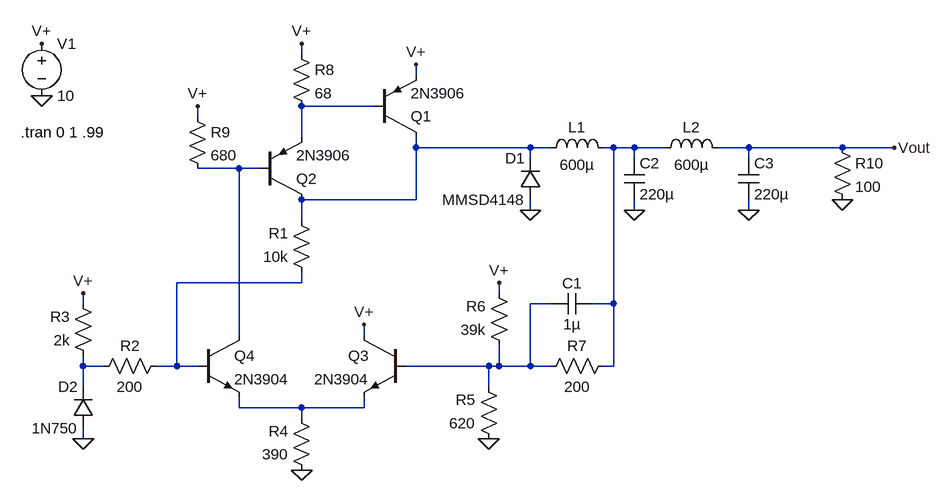
[diagram p0: schematic 09H-16.asc]
09H-16.asc, the LTspice schematic file:
Version 4.1
SHEET 1 1160 680
WIRE 176 -80 176 -96
WIRE 352 -48 352 -64
WIRE 288 0 176 0
WIRE 16 16 16 0
WIRE 176 48 176 0
WIRE 352 64 352 48
WIRE 528 64 352 64
WIRE 560 64 528 64
WIRE 656 64 640 64
WIRE 688 64 656 64
WIRE 736 64 688 64
WIRE 864 64 816 64
WIRE 1008 64 864 64
WIRE 1088 64 1008 64
WIRE 528 80 528 64
WIRE 688 80 688 64
WIRE 864 80 864 64
WIRE 80 96 16 96
WIRE 112 96 80 96
WIRE 352 144 352 64
WIRE 352 144 176 144
WIRE 528 160 528 144
WIRE 688 160 688 144
WIRE 864 160 864 144
WIRE 176 176 176 144
WIRE 176 272 176 256
WIRE 176 272 -16 272
WIRE 480 288 480 272
WIRE -160 304 -160 288
WIRE 560 304 528 304
WIRE 656 304 656 64
WIRE 656 304 624 304
WIRE 80 352 80 96
WIRE 272 352 272 336
WIRE -160 400 -160 384
WIRE -128 400 -160 400
WIRE -16 400 -16 272
WIRE -16 400 -48 400
WIRE 16 400 -16 400
WIRE 464 400 336 400
WIRE 480 400 480 368
WIRE 480 400 464 400
WIRE 528 400 528 304
WIRE 528 400 480 400
WIRE 560 400 528 400
WIRE 656 400 656 304
WIRE 656 400 640 400
WIRE -160 432 -160 400
WIRE 464 432 464 400
WIRE 80 464 80 448
WIRE 176 464 80 464
WIRE 272 464 272 448
WIRE 272 464 176 464
WIRE 176 480 176 464
WIRE -160 512 -160 496
FLAG -160 512 0
FLAG 176 560 0
FLAG 464 512 0
FLAG 528 160 0
FLAG 688 160 0
FLAG 864 160 0
FLAG -160 288 V+
FLAG 272 336 V+
FLAG 480 272 V+
FLAG 352 -64 V+
FLAG 176 -96 V+
FLAG 16 0 V+
FLAG 1088 64 Vout
FLAG -224 -16 0
FLAG -224 -96 V+
FLAG 1008 144 0
SYMBOL pnp 288 48 M180
SYMATTR InstName Q1
SYMATTR Value 2N3906
SYMBOL pnp 112 144 M180
SYMATTR InstName Q2
SYMATTR Value 2N3906
SYMBOL npn 336 352 M0
SYMATTR InstName Q3
SYMATTR Value 2N3904
SYMBOL npn 16 352 R0
SYMATTR InstName Q4
SYMATTR Value 2N3904
SYMBOL res 192 272 R180
WINDOW 0 36 76 Left 2
WINDOW 3 36 40 Left 2
SYMATTR InstName R1
SYMATTR Value 10k
SYMBOL res -32 384 R90
WINDOW 0 0 56 VBottom 2
WINDOW 3 32 56 VTop 2
SYMATTR InstName R2
SYMATTR Value 200
SYMBOL res -144 400 R180
WINDOW 0 36 76 Left 2
WINDOW 3 36 40 Left 2
SYMATTR InstName R3
SYMATTR Value 2k
SYMBOL res 192 576 R180
WINDOW 0 36 76 Left 2
WINDOW 3 36 40 Left 2
SYMATTR InstName R4
SYMATTR Value 390
SYMBOL res 480 528 R180
WINDOW 0 36 76 Left 2
WINDOW 3 36 40 Left 2
SYMATTR InstName R5
SYMATTR Value 620
SYMBOL res 496 384 R180
WINDOW 0 36 76 Left 2
WINDOW 3 36 40 Left 2
SYMATTR InstName R6
SYMATTR Value 39k
SYMBOL res 544 416 R270
WINDOW 0 32 56 VTop 2
WINDOW 3 0 56 VBottom 2
SYMATTR InstName R7
SYMATTR Value 200
SYMBOL cap 624 288 R90
WINDOW 0 0 32 VBottom 2
WINDOW 3 32 32 VTop 2
SYMATTR InstName C1
SYMATTR Value 1µ
SYMBOL cap 672 80 R0
SYMATTR InstName C2
SYMATTR Value 220µ
SYMBOL cap 848 80 R0
SYMATTR InstName C3
SYMATTR Value 220µ
SYMBOL ind 544 80 R270
WINDOW 0 32 56 VTop 2
WINDOW 3 5 56 VBottom 2
SYMATTR InstName L1
SYMATTR Value 600µ
SYMBOL ind 720 80 R270
WINDOW 0 32 56 VTop 2
WINDOW 3 5 56 VBottom 2
SYMATTR InstName L2
SYMATTR Value 600µ
SYMBOL diode 544 144 R180
WINDOW 0 24 64 Left 2
WINDOW 3 24 0 Left 2
SYMATTR InstName D1
SYMATTR Value MMSD4148
SYMBOL diode -144 496 R180
WINDOW 0 24 64 Left 2
WINDOW 3 24 0 Left 2
SYMATTR InstName D2
SYMATTR Value 1N750
SYMATTR Description Diode
SYMATTR Type diode
SYMBOL res 160 -96 R0
SYMATTR InstName R8
SYMATTR Value 68
SYMBOL res 0 0 R0
SYMATTR InstName R9
SYMATTR Value 680
SYMBOL voltage -224 -112 R0
WINDOW 123 0 0 Left 0
WINDOW 39 0 0 Left 0
SYMATTR InstName V1
SYMATTR Value 10
SYMBOL res 992 48 R0
SYMATTR InstName R10
SYMATTR Value 100
TEXT -256 40 Left 2 !.tran 0 1 .99

The netlist it stands for:
* 09H-16.asc
Q1 N002 N001 V+ 0 2N3906
Q2 N002 N004 N001 0 2N3906
Q3 V+ N006 N008 0 2N3904
Q4 N004 N005 N008 0 2N3904
R1 N005 N002 10k
R2 N005 N007 200
R3 N007 V+ 2k
R4 0 N008 390
R5 0 N006 620
R6 N006 V+ 39k
R7 N006 N003 200
C1 N003 N006 1µ
C2 N003 0 220µ
C3 Vout 0 220µ
L1 N002 N003 600µ
L2 N003 Vout 600µ
D1 0 N002 MMSD4148
D2 0 N007 1N750
R8 V+ N001 68
R9 V+ N004 680
V1 V+ 0 10
R10 Vout 0 100
.model D D
.lib standard.dio
.model NPN NPN
.model PNP PNP
.lib standard.bjt
.tran 0 1 .99
.backanno
.end